# EasyEDA schematic DispositivoH2O1Esquemático.json
TITLE: Dispositivo H2O; REV: 1.0; Date: 2020-11-25; Sheet: 1/1; Drawn By: J. Williams Escobar; Company: ITE
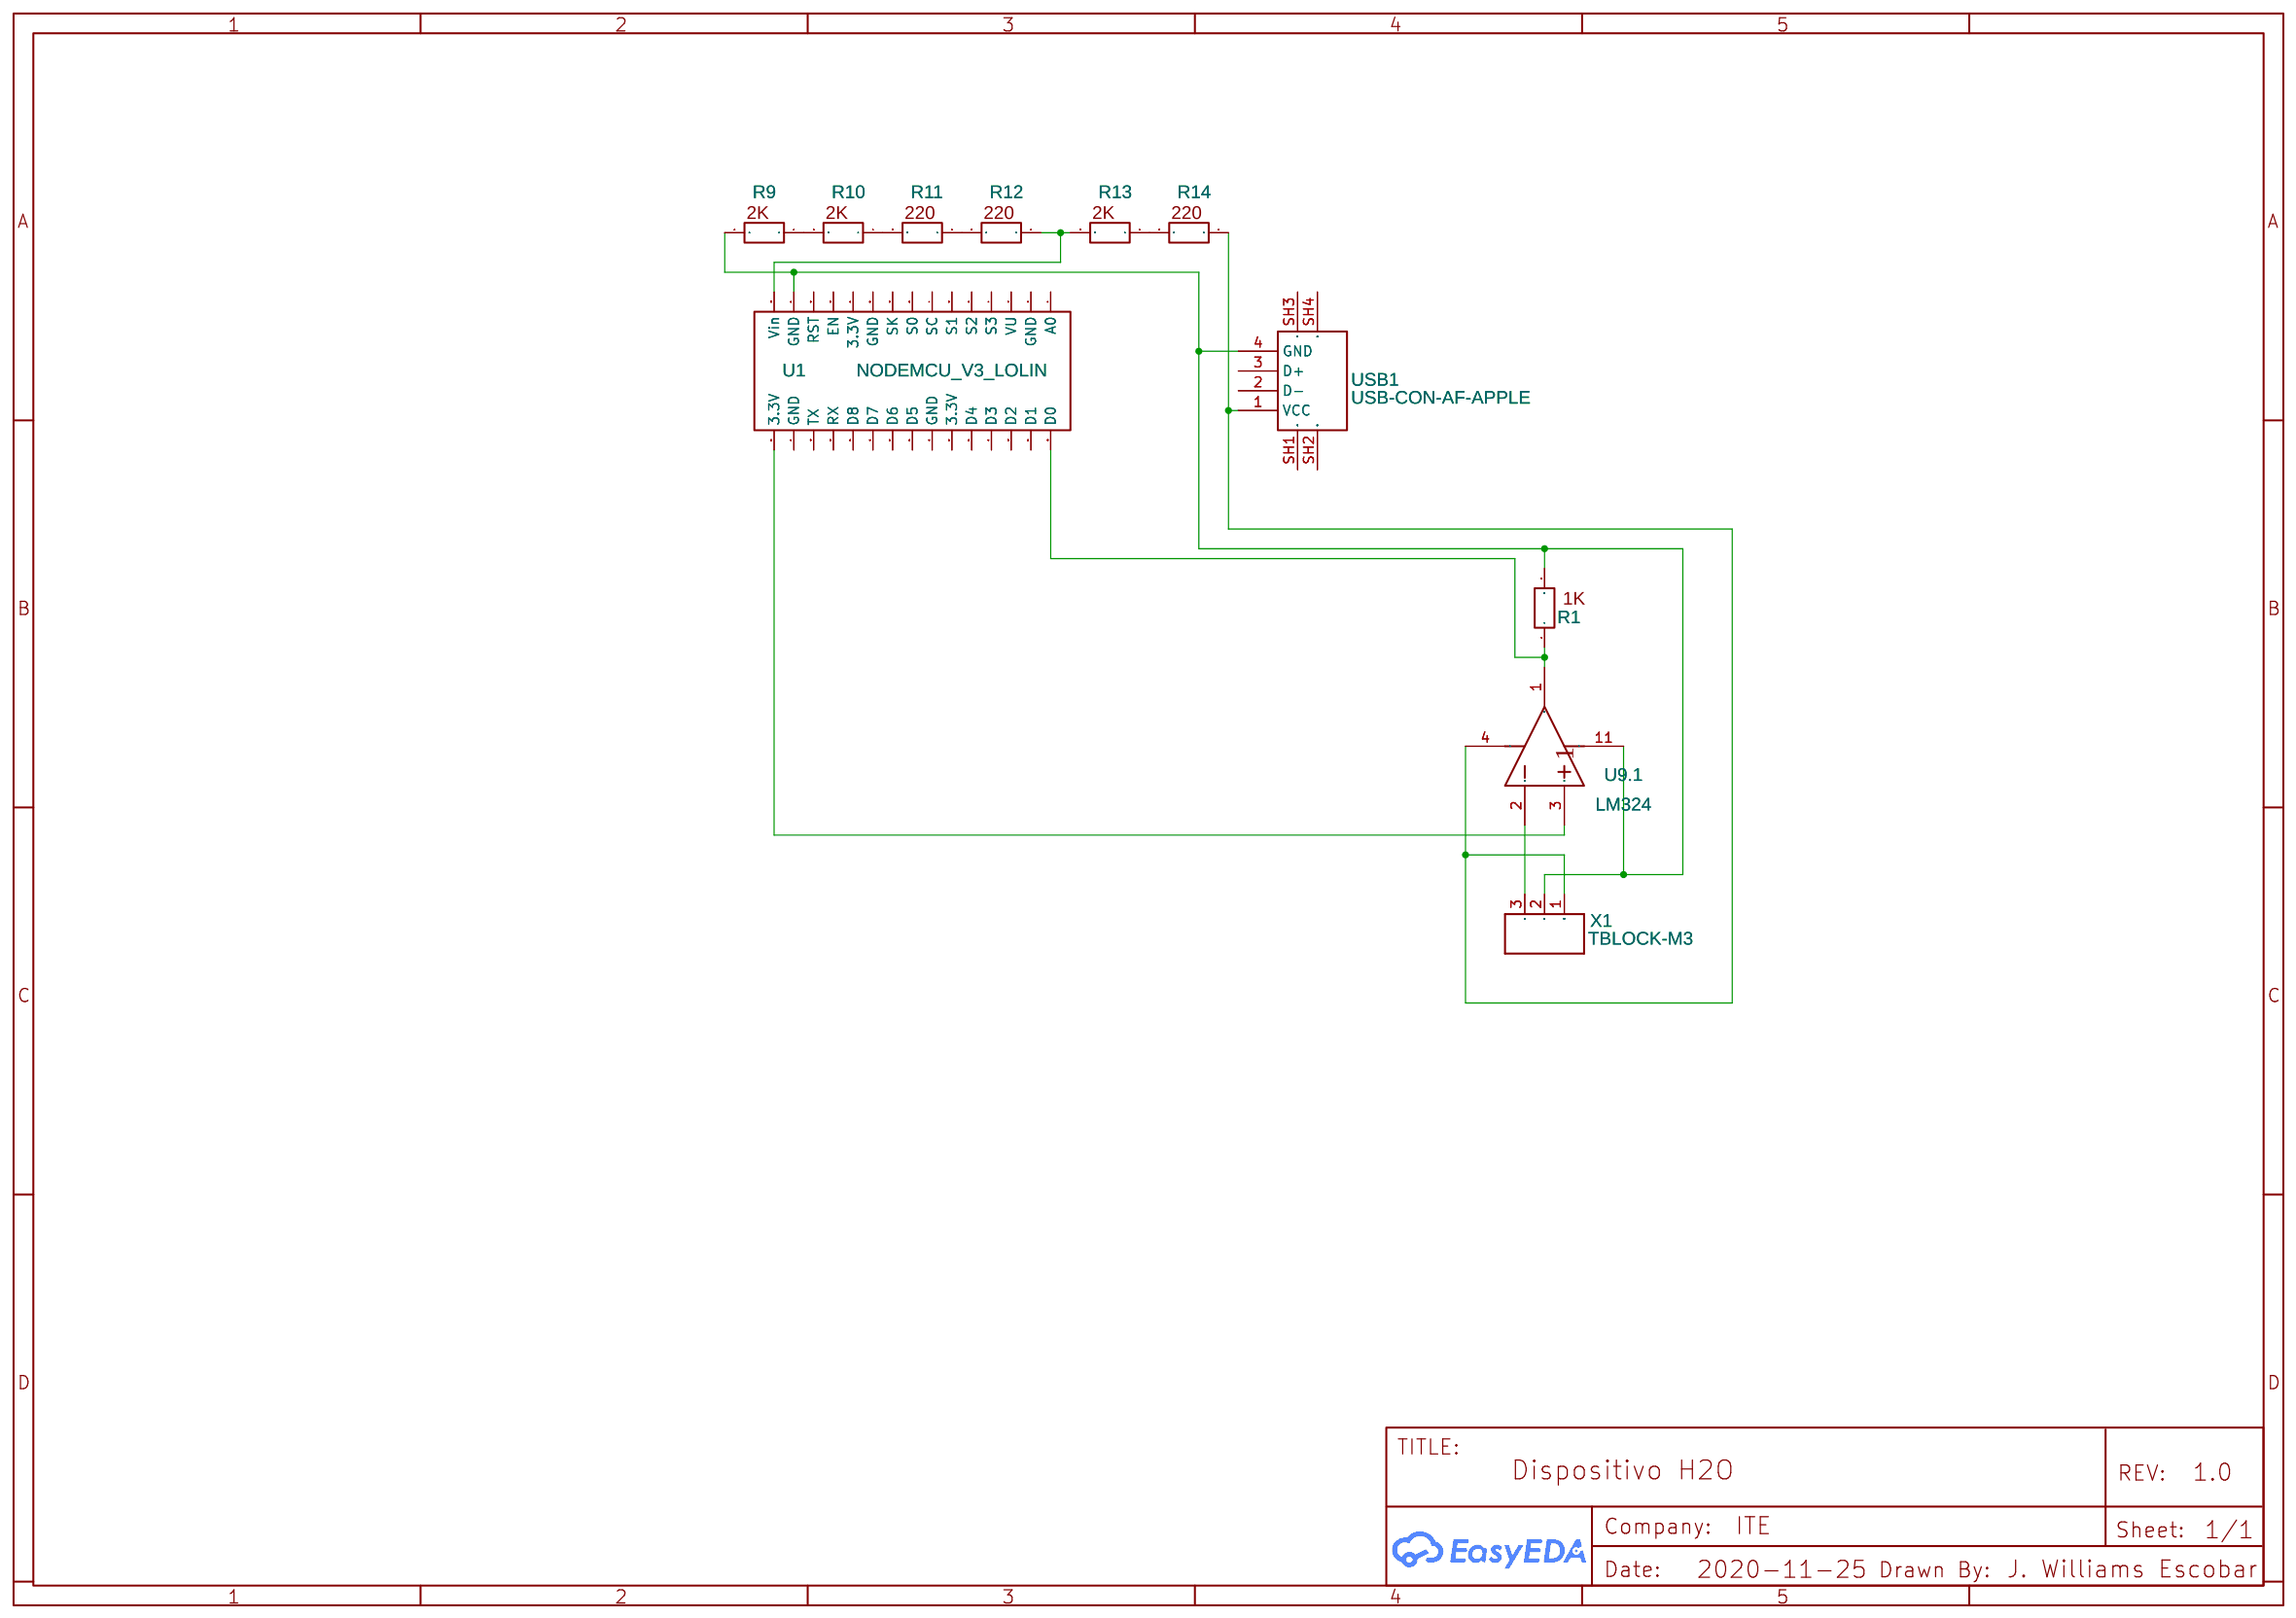
[diagram p0: schematic sheet]

## Parts
R1  R9  [RESISTOR 1K]
R9  R9  [RESISTOR 1K]
R10  R16  [RESISTOR 1K]
R11  R17  [RESISTOR 1K]
R12  R9  [RESISTOR 1K]
R13  R9  [RESISTOR 1K]
R14  R9  [RESISTOR 1K]
U1  NODEMCU_V3_LOLIN  [NODEMCU V3 LOLIN]
U9  LM324  [SOP-14_L10.3-W5.3-P1.27-LS7.8-BL]  (section 1)
USB1  USB-CON-AF-APPLE  [USB-A-SMD_AF-APPLE-10.6]
X1  TBLOCK-M3  [TBLOCK-M3]

## Library data of the parts
R1 R9-R14 = Resistencia 1K: Contributor: luisavileshernandez
U1 = NODEMCU_V3_LOLIN: Manufacturer Part: NodeMcu V3 LoLin; Contributor: Priyanshu Kumar
U9 = LM324: Supplier: LCSC; Supplier Part: C351427; Manufacturer: PUOLOP; subpart_no: 1
USB1 = USB-CON-AF-APPLE: Supplier: LCSC; Manufacturer: ValuePro; image: //image.lceda.cn/szlcsc/C42567.jpg; Supplier Part: C42567
X1 = TBLOCK-M3: Contributor: amit_9in87

## Nets
Net-(R1-1): R1.1 U1.30(D0) U9.1(OUT)
Net-(R1-2): R1.2 R9.2 U1.14(GND) U9.11(V-) USB1.4(GND) X1.2(P$2)
Net-(R9-1): R9.1 R10.2
Net-(R10-1): R10.1 R11.2
Net-(R11-1): R11.1 R12.2
Net-(R12-1): R12.1 R13.2 U1.15(Vin)
Net-(R13-1): R13.1 R14.2
Net-(R14-1): R14.1 U9.4(V+) USB1.1(VCC) X1.1(P$1)
Net-(U1-16): U1.16(3.3V) U9.3(IN+)
Net-(U9.1-2): U9.2(IN-) X1.3(P$3)

Not connected (* = marked no-connect by the designer): U1 1(A0) 2(GND) 3(VU) 4(S3) 5(S2) 6(S1) 7(SC) 8(S0) 9(SK) 10(GND) 11(3.3V) 12(EN) 13(RST) 17(GND) 18(TX) 19(RX) 20(D8) 21(D7) 22(D6) 23(D5) 24(GND) 25(3.3V) 26(D4) 27(D3) 28(D2) 29(D1); USB1 2(D-) 3(D+) SH1 SH2 SH3 SH4
